# Altium schematic sheet TI_SN74LVCH16T245_3V3_to_5V.SchDoc
size A4; CompanyName: Technische Hochschule Nürnberg Georg Simon Ohm; Address1: Fürther Straße 250; Address2: 90429 Nürnberg; Address3: GERMANY; CompanyName2: Institut ELSYS
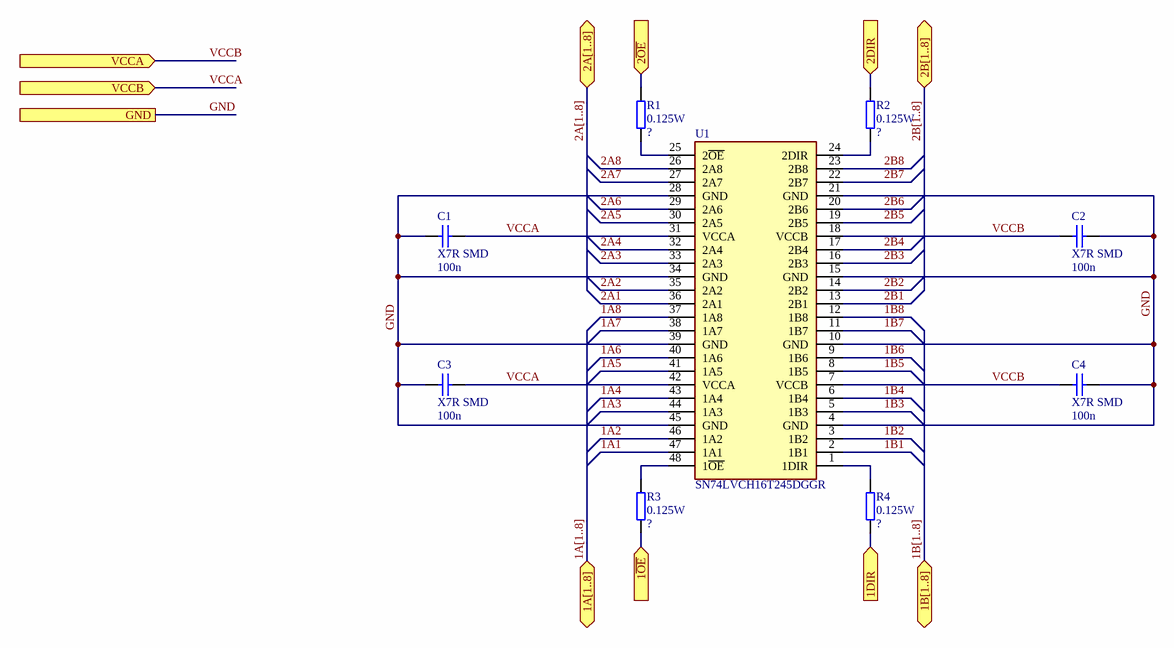
[diagram p0: TI_SN74LVCH16T245_3V3_to_5V.SchDoc]

## Parts
C1  X7R SMD  value 100n  [SMD0805_LOW_DENS]
C2  X7R SMD  value 100n  [SMD0805_LOW_DENS]
C3  X7R SMD  value 100n  [SMD0805_LOW_DENS]
C4  X7R SMD  value 100n  [SMD0805_LOW_DENS]
R1  0.125W  [SMD0805_LOW_DENS]
R2  0.125W  [SMD0805_LOW_DENS]
R3  0.125W  [SMD0805_LOW_DENS]
R4  0.125W  [SMD0805_LOW_DENS]
U1  SN74LVCH16T245DGGR  [SSOP64P1040X279-48M]

## Ports
1A[1..8] (bidir), 1B[1..8] (bidir), 1DIR (in), 1~{OE} (in), 2A[1..8] (bidir), 2B[1..8] (bidir), 2DIR (in), 2~{OE} (in), GND, VCCA (in), VCCB (in)

## Nets
1A1: U1.47(1A1)
1A2: U1.46(1A2)
1A3: U1.44(1A3)
1A4: U1.43(1A4)
1A5: U1.41(1A5)
1A6: U1.40(1A6)
1A7: U1.38(1A7)
1A8: U1.37(1A8)
1B1: U1.2(1B1)
1B2: U1.3(1B2)
1B3: U1.5(1B3)
1B4: U1.6(1B4)
1B5: U1.8(1B5)
1B6: U1.9(1B6)
1B7: U1.11(1B7)
1B8: U1.12(1B8)
1DIR: R4.2 ; port 1DIR
1~{OE}: R3.2 ; port 1~{OE}
2A1: U1.36(2A1)
2A2: U1.35(2A2)
2A3: U1.33(2A3)
2A4: U1.32(2A4)
2A5: U1.30(2A5)
2A6: U1.29(2A6)
2A7: U1.27(2A7)
2A8: U1.26(2A8)
2B1: U1.13(2B1)
2B2: U1.14(2B2)
2B3: U1.16(2B3)
2B4: U1.17(2B4)
2B5: U1.19(2B5)
2B6: U1.20(2B6)
2B7: U1.22(2B7)
2B8: U1.23(2B8)
2DIR: R2.1 ; port 2DIR
2~{OE}: R1.1 ; port 2~{OE}
GND: C1.1 C2.1 C3.2 C4.2 U1.4(GND) U1.10(GND) U1.15(GND) U1.21(GND) U1.28(GND) U1.34(GND) U1.39(GND) U1.45(GND) ; port GND
VCCA: C1.2 C3.1 U1.31(VCCA) U1.42(VCCA) ; port VCCB
VCCB: C2.2 C4.1 U1.7(VCCB) U1.18(VCCB) ; port VCCA
NetR1_2: R1.2 U1.25(2~{OE})
NetR2_2: R2.2 U1.24(2DIR)
NetR3_1: R3.1 U1.48(1~{OE})
NetR4_1: R4.1 U1.1(1DIR)

## Buses and harness runs
bus 1A[1..8] = port 1A[1..8]
bus 1B[1..8] = port 1B[1..8]
bus 2A[1..8] = port 2A[1..8]
bus 2B[1..8] = port 2B[1..8]

## Notes on the sheet
- Title
- Size:
- Date:
- A4
- Revision:
- Time:
- Sheet
- of
- Author:
- Project:

## Library data of the parts
C1-C4 = C_X7R_SMALL: Standard X7R SMD capacitor. This kind of dielectricum should be used for decoupling applications. Bigger capacity is available but not for the given voltage rating; MPN: C<pkg><cap><tol><volt>RACTU; MF: KEMET; CL 1 Info: Datasheet; Max Voltage: 100; Min Cap: 10p; Voltage Sym: 5; Tolerance Sym: J; created: 2019-12-08_Thilo_Wendt; Supplier: https://de.farnell.com/w/c/passive-bauelemente/kondensatoren/keramikkondensatoren/keramik-vielschichtkondensatoren-mlcc-smd?brand=kemet&kapazitatstoleranz=posneg-10pc&dielektrikum=x7r; ComponentLink1Description: *; ComponentLink 1: *; ComponentLink: *; CL 1: https://content.kemet.com/datasheets/KEM_C1002_X7R_SMD.pdf; Max Cap: 100n
R1-R4 = R_0.125W: Standard 0.125W thick film resistor. See datasheet for more informations about tolerance etc.; MPN: ERJU<pkg><tol><val><pkg_meth>; MF: Panasonic; Max Voltage: 150; Tolerance Sym: F; created: 2019-12-08_Thilo_Wendt; Supplier: https://de.farnell.com/search?st=erju03; ComponentLink1Description: *; ComponentLink 1: *; ComponentLink: *; CL 1: https://www.mouser.de/datasheet/2/315/AOA0000C334-1314047.pdf; CL 1 Info: Datasheet; Value: ?
U1 = SN74LVCH16T245DGGR: Direction controlled 16 channel level shifter with active driver. Voltage range 1.8V to 5V.; Manufacturer_Name: Texas Instruments; Datasheet Link: http://www.ti.com/lit/gpn/sn74lvch16t245; Height: 1.2mm; Manufacturer_Part_Number: SN74LVCH16T245DGGR; Mouser Part Number: 595-SN74LVCH16T245GR; Mouser Price/Stock: https://www.mouser.com/Search/Refine.aspx?Keyword=595-SN74LVCH16T245GR; RS Part Number: 8143916P; RS Price/Stock: http://uk.rs-online.com/web/p/products/8143916P